# EAGLE design Main v1 (EAGLE 9.7.0)
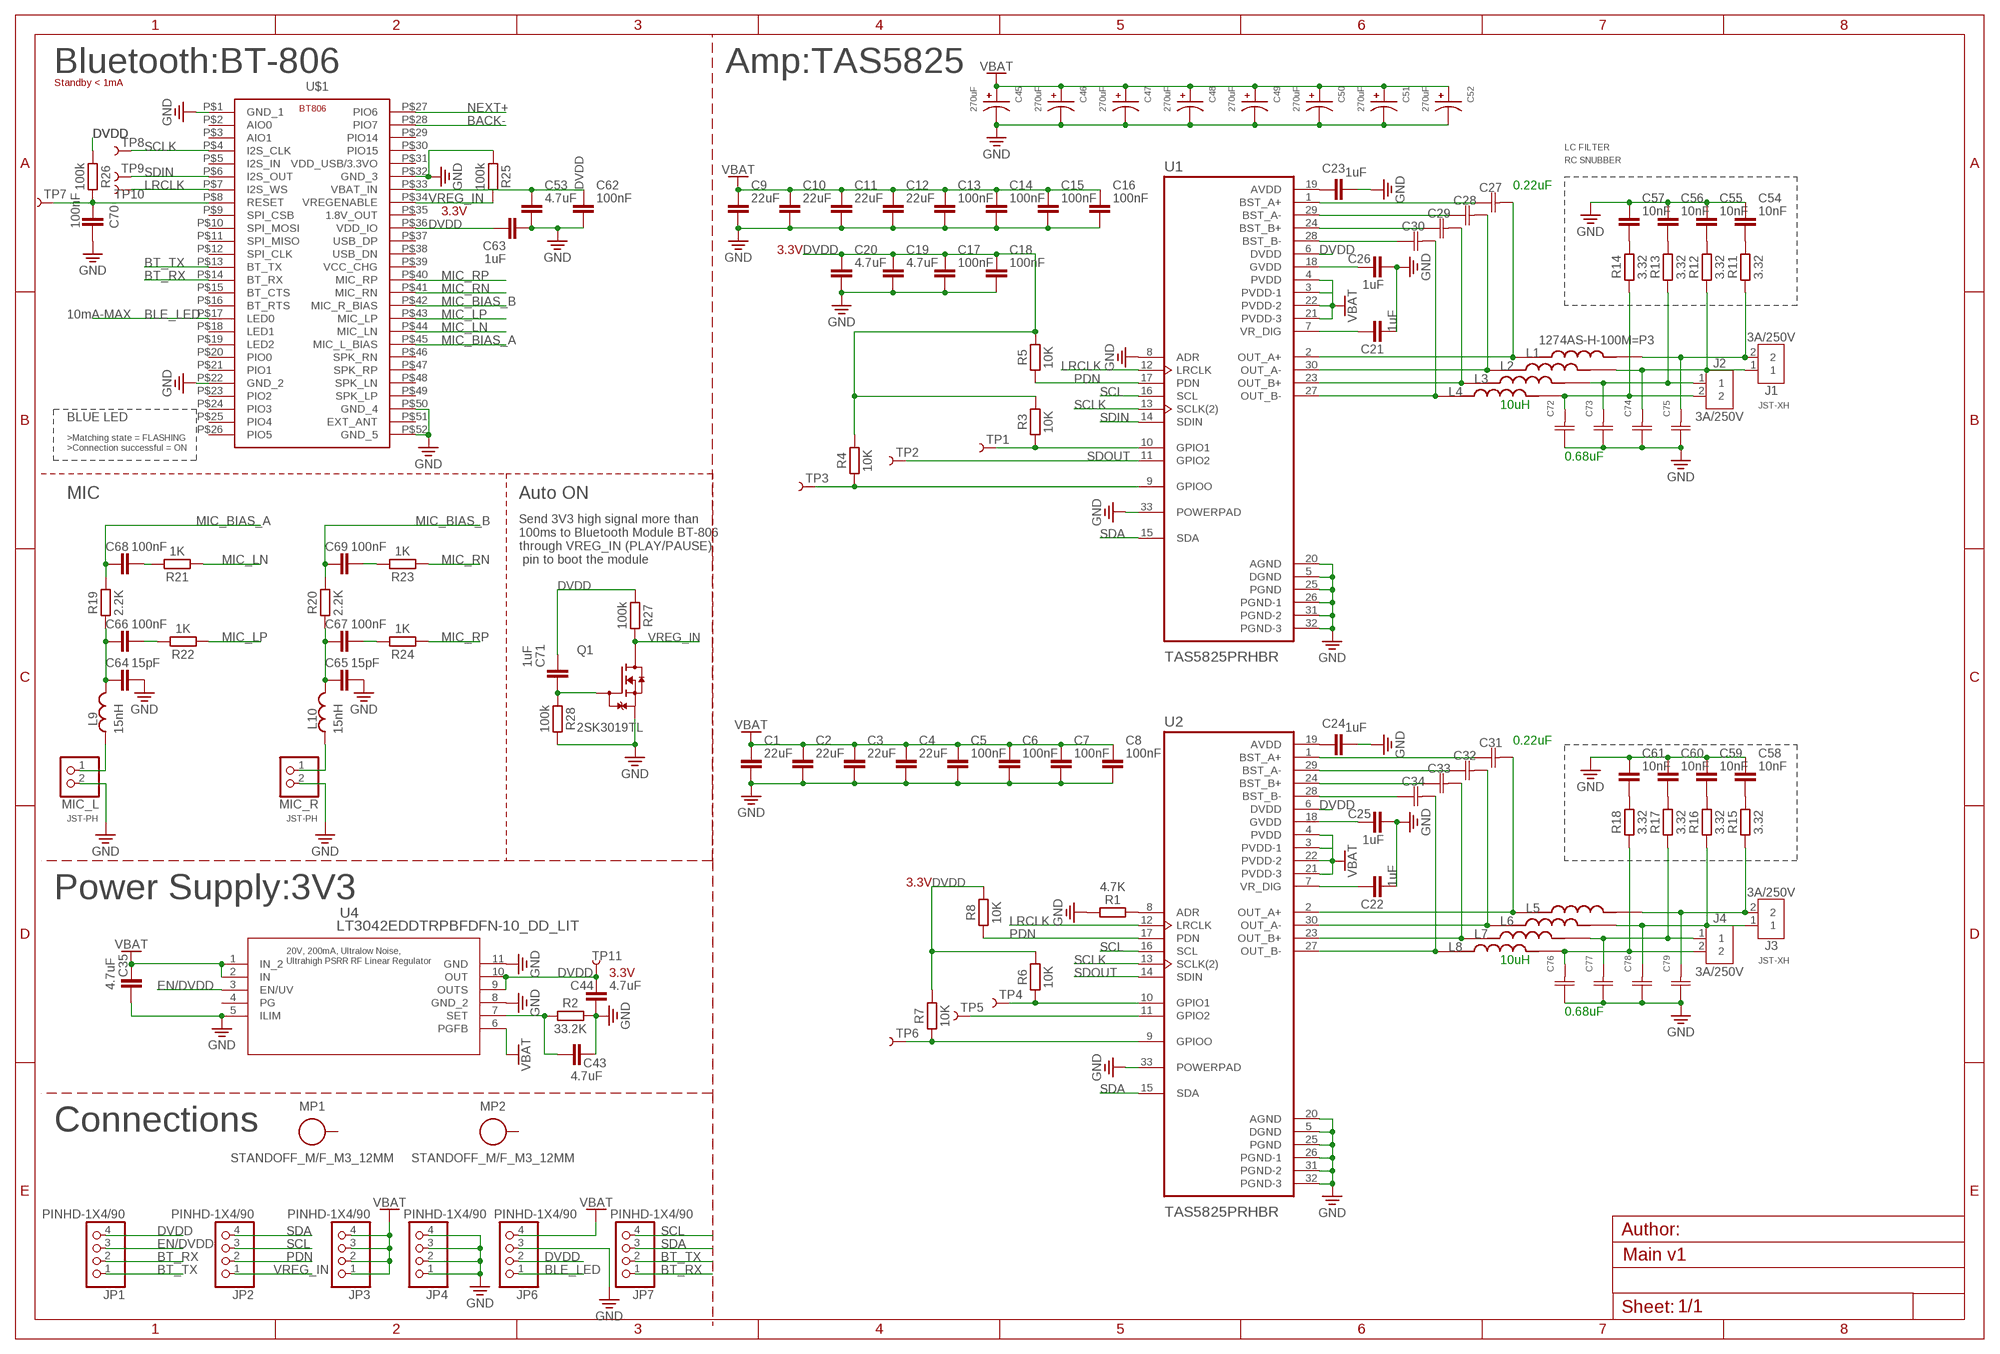
[diagram p0: schematic, sheet 1]

## Parts
C1  22uF  C_CHIP-0805(2012-METRIC)  [CAPC2012X110]
C2  22uF  C_CHIP-0805(2012-METRIC)  [CAPC2012X110]
C3  22uF  C_CHIP-0805(2012-METRIC)  [CAPC2012X110]
C4  22uF  C_CHIP-0805(2012-METRIC)  [CAPC2012X110]
C5  100nF  C_CHIP-0805(2012-METRIC)  [CAPC2012X110]
C6  100nF  C_CHIP-0805(2012-METRIC)  [CAPC2012X110]
C7  100nF  C_CHIP-0805(2012-METRIC)  [CAPC2012X110]
C8  100nF  C_CHIP-0805(2012-METRIC)  [CAPC2012X110]
C9  22uF  C_CHIP-0805(2012-METRIC)  [CAPC2012X110]
C10  22uF  C_CHIP-0805(2012-METRIC)  [CAPC2012X110]
C11  22uF  C_CHIP-0805(2012-METRIC)  [CAPC2012X110]
C12  22uF  C_CHIP-0805(2012-METRIC)  [CAPC2012X110]
C13  100nF  C_CHIP-0805(2012-METRIC)  [CAPC2012X110]
C14  100nF  C_CHIP-0805(2012-METRIC)  [CAPC2012X110]
C15  100nF  C_CHIP-0805(2012-METRIC)  [CAPC2012X110]
C16  100nF  C_CHIP-0805(2012-METRIC)  [CAPC2012X110]
C17  100nF  C_CHIP-0805(2012-METRIC)  [CAPC2012X110]
C18  100nF  C_CHIP-0805(2012-METRIC)  [CAPC2012X110]
C19  4.7uF  C_CHIP-1206(3216-METRIC)  [CAPC3216X135]
C20  4.7uF  C_CHIP-1206(3216-METRIC)  [CAPC3216X135]
C21  1uF  C_CHIP-0805(2012-METRIC)  [CAPC2012X110]
C22  1uF  C_CHIP-0805(2012-METRIC)  [CAPC2012X110]
C23  1uF  C_CHIP-0805(2012-METRIC)  [CAPC2012X110]
C24  1uF  C_CHIP-0805(2012-METRIC)  [CAPC2012X110]
C25  1uF  C_CHIP-0805(2012-METRIC)  [CAPC2012X110]
C26  1uF  C_CHIP-0805(2012-METRIC)  [CAPC2012X110]
C27  0.22uF  PHE426HJ6220JR05CAPM7.2X7.2_5_1_VIS  [CAPM7.2X7.2_5_1_VIS]
C28  0.22uF  PHE426HJ6220JR05CAPM7.2X7.2_5_1_VIS  [CAPM7.2X7.2_5_1_VIS]
C29  0.22uF  PHE426HJ6220JR05CAPM7.2X7.2_5_1_VIS  [CAPM7.2X7.2_5_1_VIS]
C30  0.22uF  PHE426HJ6220JR05CAPM7.2X7.2_5_1_VIS  [CAPM7.2X7.2_5_1_VIS]
C31  0.22uF  PHE426HJ6220JR05CAPM7.2X7.2_5_1_VIS  [CAPM7.2X7.2_5_1_VIS]
C32  0.22uF  PHE426HJ6220JR05CAPM7.2X7.2_5_1_VIS  [CAPM7.2X7.2_5_1_VIS]
C33  0.22uF  PHE426HJ6220JR05CAPM7.2X7.2_5_1_VIS  [CAPM7.2X7.2_5_1_VIS]
C34  0.22uF  PHE426HJ6220JR05CAPM7.2X7.2_5_1_VIS  [CAPM7.2X7.2_5_1_VIS]
C35  4.7uF  C_CHIP-0805(2012-METRIC)  [CAPC2012X110]
C43  4.7uF  C_CHIP-0805(2012-METRIC)  [CAPC2012X110]
C44  4.7uF  C_CHIP-0805(2012-METRIC)  [CAPC2012X110]
C45  270uF  16SVPG270M  [CAP_16SVPG270M]
C46  270uF  16SVPG270M  [CAP_16SVPG270M]
C47  270uF  16SVPG270M  [CAP_16SVPG270M]
C48  270uF  16SVPG270M  [CAP_16SVPG270M]
C49  270uF  16SVPG270M  [CAP_16SVPG270M]
C50  270uF  16SVPG270M  [CAP_16SVPG270M]
C51  270uF  16SVPG270M  [CAP_16SVPG270M]
C52  270uF  16SVPG270M  [CAP_16SVPG270M]
C53  4.7uF  C_CHIP-0805(2012-METRIC)  [CAPC2012X110]
C54  10nF  C_CHIP-0805(2012-METRIC)  [CAPC2012X110]
C55  10nF  C_CHIP-0805(2012-METRIC)  [CAPC2012X110]
C56  10nF  C_CHIP-0805(2012-METRIC)  [CAPC2012X110]
C57  10nF  C_CHIP-0805(2012-METRIC)  [CAPC2012X110]
C58  10nF  C_CHIP-0805(2012-METRIC)  [CAPC2012X110]
C59  10nF  C_CHIP-0805(2012-METRIC)  [CAPC2012X110]
C60  10nF  C_CHIP-0805(2012-METRIC)  [CAPC2012X110]
C61  10nF  C_CHIP-0805(2012-METRIC)  [CAPC2012X110]
C62  100nF  C_CHIP-0805(2012-METRIC)  [CAPC2012X110]
C63  1uF  C_CHIP-0805(2012-METRIC)  [CAPC2012X110]
C64  15pF  C_CHIP-0402(1005-METRIC)  [CAPC1005X60]
C65  15pF  C_CHIP-0402(1005-METRIC)  [CAPC1005X60]
C66  100nF  C_CHIP-0402(1005-METRIC)  [CAPC1005X60]
C67  100nF  C_CHIP-0402(1005-METRIC)  [CAPC1005X60]
C68  100nF  C_CHIP-0402(1005-METRIC)  [CAPC1005X60]
C69  100nF  C_CHIP-0402(1005-METRIC)  [CAPC1005X60]
C70  100nF  C_CHIP-0402(1005-METRIC)  [CAPC1005X60]
C71  1uF  C_CHIP-0805(2012-METRIC)  [CAPC2012X110]
C72  MMK5684J63J03L16.5TR18CAPM7.2X4.5_5_VIS  [CAPM7.2X4.5_5_VIS]
C73  MMK5684J63J03L16.5TR18CAPM7.2X4.5_5_VIS  [CAPM7.2X4.5_5_VIS]
C74  MMK5684J63J03L16.5TR18CAPM7.2X4.5_5_VIS  [CAPM7.2X4.5_5_VIS]
C75  MMK5684J63J03L16.5TR18CAPM7.2X4.5_5_VIS  [CAPM7.2X4.5_5_VIS]
C76  MMK5684J63J03L16.5TR18CAPM7.2X4.5_5_VIS  [CAPM7.2X4.5_5_VIS]
C77  MMK5684J63J03L16.5TR18CAPM7.2X4.5_5_VIS  [CAPM7.2X4.5_5_VIS]
C78  MMK5684J63J03L16.5TR18CAPM7.2X4.5_5_VIS  [CAPM7.2X4.5_5_VIS]
C79  MMK5684J63J03L16.5TR18CAPM7.2X4.5_5_VIS  [CAPM7.2X4.5_5_VIS]
J1  3A/250V  B2B-XH-A  [B2B-XH-A]
J2  3A/250V  B2B-XH-A  [B2B-XH-A]
J3  3A/250V  B2B-XH-A  [B2B-XH-A]
J4  3A/250V  B2B-XH-A  [B2B-XH-A]
JP1  PINHD-1X4/90  [1X04/90]
JP2  PINHD-1X4/90  [1X04/90]
JP3  PINHD-1X4/90  [1X04/90]
JP4  PINHD-1X4/90  [1X04/90]
JP6  PINHD-1X4/90  [1X04/90]
JP7  PINHD-1X4/90  [1X04/90]
L1  1274AS-H-100M=P3  [IND_1274AS-H-100M=P3]
L2  1274AS-H-100M=P3  [IND_1274AS-H-100M=P3]
L3  1274AS-H-100M=P3  [IND_1274AS-H-100M=P3]
L4  1274AS-H-100M=P3  [IND_1274AS-H-100M=P3]
L5  1274AS-H-100M=P3  [IND_1274AS-H-100M=P3]
L6  1274AS-H-100M=P3  [IND_1274AS-H-100M=P3]
L7  1274AS-H-100M=P3  [IND_1274AS-H-100M=P3]
L8  1274AS-H-100M=P3  [IND_1274AS-H-100M=P3]
L9  15nH  L_CHIP-0402(1006-METRIC)  [INDC1006X60N]
L10  15nH  L_CHIP-0402(1006-METRIC)  [INDC1006X60N]
MIC_L  JST_2PIN-THM  [JST-PH-2-THM]
MIC_R  JST_2PIN-THM  [JST-PH-2-THM]
MP1  STANDOFF_M/F_M3_12MM  [STANDOFF_HEX_MALE-FEMALE_550X1200_M3X0.5_MTGP850H320]
MP2  STANDOFF_M/F_M3_12MM  [STANDOFF_HEX_MALE-FEMALE_550X1200_M3X0.5_MTGP850H320]
Q1  2SK3019TL  [TRANS_2SK3019TL]
R1  4.7K  R_CHIP-0402(1005-METRIC)  [RESC1005X40]
R2  33.2K  R_CHIP-0402(1005-METRIC)  [RESC1005X40]
R3  10K  R_CHIP-0402(1005-METRIC)  [RESC1005X40]
R4  10K  R_CHIP-0402(1005-METRIC)  [RESC1005X40]
R5  10K  R_CHIP-0402(1005-METRIC)  [RESC1005X40]
R6  10K  R_CHIP-0402(1005-METRIC)  [RESC1005X40]
R7  10K  R_CHIP-0402(1005-METRIC)  [RESC1005X40]
R8  10K  R_CHIP-0402(1005-METRIC)  [RESC1005X40]
R11  3.32  R_CHIP-0402(1005-METRIC)  [RESC1005X40]
R12  3.32  R_CHIP-0402(1005-METRIC)  [RESC1005X40]
R13  3.32  R_CHIP-0402(1005-METRIC)  [RESC1005X40]
R14  3.32  R_CHIP-0402(1005-METRIC)  [RESC1005X40]
R15  3.32  R_CHIP-0402(1005-METRIC)  [RESC1005X40]
R16  3.32  R_CHIP-0402(1005-METRIC)  [RESC1005X40]
R17  3.32  R_CHIP-0402(1005-METRIC)  [RESC1005X40]
R18  3.32  R_CHIP-0402(1005-METRIC)  [RESC1005X40]
R19  2.2K  R_CHIP-0402(1005-METRIC)  [RESC1005X40]
R20  2.2K  R_CHIP-0402(1005-METRIC)  [RESC1005X40]
R21  1K  R_CHIP-0402(1005-METRIC)  [RESC1005X40]
R22  1K  R_CHIP-0402(1005-METRIC)  [RESC1005X40]
R23  1K  R_CHIP-0402(1005-METRIC)  [RESC1005X40]
R24  1K  R_CHIP-0402(1005-METRIC)  [RESC1005X40]
R25  100k  R_CHIP-0402(1005-METRIC)  [RESC1005X40]
R26  100k  R_CHIP-0402(1005-METRIC)  [RESC1005X40]
R27  100k  R_CHIP-0402(1005-METRIC)  [RESC1005X40]
R28  100k  R_CHIP-0402(1005-METRIC)  [RESC1005X40]
TP1  TEST-POINT3  [PAD.03X.03]
TP2  TEST-POINT3  [PAD.03X.03]
TP3  TEST-POINT3  [PAD.03X.03]
TP4  TEST-POINT3  [PAD.03X.03]
TP5  TEST-POINT3  [PAD.03X.03]
TP6  TEST-POINT3  [PAD.03X.03]
TP7  TEST-POINT3  [PAD.03X.03]
TP8  TEST-POINT3X5  [PAD.03X.05]
TP9  TEST-POINT3X5  [PAD.03X.05]
TP10  TEST-POINT3X5  [PAD.03X.05]
TP11  TEST-POINT3X5  [PAD.03X.05]
U1  TAS5825PRHBR  [IC_ADS125H01IRHBT]
U2  TAS5825PRHBR  [IC_ADS125H01IRHBT]
U4  LT3042EDDTRPBFDFN-10_DD_LIT  [DFN-10_DD_LIT]
U$1  BT806  [BT806]

## Nets
BACK-: U$1.P$28(PIO7)
BLE_LED: JP6.1 U$1.P$17(LED0)
BT_RX: JP1.2 JP7.1 U$1.P$14(BT_RX)
BT_TX: JP1.1 JP7.2 U$1.P$13(BT_TX)
DVDD: C17.1 C18.1 C19.1 C20.1 C44.2 C53.1 C62.1 C63.1 C71.1 JP1.4 JP6.2 R3.2 R4.2 R5.2 R6.2 R7.2 R8.2 R26.1 R27.1 TP11.P$1 U1.6(DVDD) U2.6(DVDD) U4.9(OUTS) U4.10(OUT) U$1.P$33(VBAT_IN) U$1.P$36(VDD_IO)
EN/DVDD: JP1.3 U4.3(EN/UV)
GND: C1.2 C2.2 C3.2 C4.2 C5.2 C6.2 C7.2 C8.2 C9.2 C10.2 C11.2 C12.2 C13.2 C14.2 C15.2 C16.2 C17.2 C18.2 C19.2 C20.2 C21.2 C22.2 C23.2 C24.2 C25.2 C26.2 C35.1 C43.2 C44.1 C45.2 C46.2 C47.2 C48.2 C49.2 C50.2 C51.2 C52.2 C53.2 C54.1 C55.1 C56.1 C57.1 C58.1 C59.1 C60.1 C61.1 C62.2 C63.2 C64.2 C65.2 C70.1 C72.1 C73.1 C74.1 C75.1 C76.1 C77.1 C78.1 C79.1 JP4.1 JP4.2 JP4.3 JP4.4 JP6.3 MIC_L.2 MIC_R.2 Q1.1(S) R1.1 R2.2 R25.1 R28.2 U1.5(DGND) U1.8(ADR) U1.20(AGND) U1.25(PGND) U1.26(PGND-1) U1.31(PGND-2) U1.32(PGND-3) U1.33(POWERPAD) U2.5(DGND) U2.20(AGND) U2.25(PGND) U2.26(PGND-1) U2.31(PGND-2) U2.32(PGND-3) U2.33(POWERPAD) U4.5(ILIM) U4.8(GND_2) U4.11(GND) U$1.P$1(GND_1) U$1.P$22(GND_2) U$1.P$32(GND_3) U$1.P$50(GND_4) U$1.P$52(GND_5)
LRCLK: TP10.P$1 U1.12(LRCLK) U2.12(LRCLK) U$1.P$7(I2S_WS)
MIC_BIAS_A: C68.1 R19.2 U$1.P$45(MIC_L_BIAS)
MIC_BIAS_B: C69.1 R20.2 U$1.P$42(MIC_R_BIAS)
MIC_LN: R21.1 U$1.P$44(MIC_LN)
MIC_LP: R22.1 U$1.P$43(MIC_LP)
MIC_RN: R23.1 U$1.P$41(MIC_RN)
MIC_RP: R24.1 U$1.P$40(MIC_RP)
N$1: R1.2 U2.8(ADR)
N$2: C24.1 U2.19(AVDD)
N$3: C23.1 U1.19(AVDD)
N$4: C26.1 U1.18(GVDD)
N$5: C21.1 U1.7(VR_DIG)
N$6: C25.1 U2.18(GVDD)
N$7: C22.1 U2.7(VR_DIG)
N$8: C27.1 U1.1(BST_A+)
N$9: C28.1 U1.29(BST_A-)
N$10: C29.1 U1.24(BST_B+)
N$11: C30.1 U1.28(BST_B-)
N$12: C31.1 U2.1(BST_A+)
N$13: C32.1 U2.29(BST_A-)
N$14: C33.1 U2.24(BST_B+)
N$15: C34.1 U2.28(BST_B-)
N$16: C27.2 L1.1 U1.2(OUT_A+)
N$17: C28.2 L2.1 U1.30(OUT_A-)
N$18: C29.2 L3.1 U1.23(OUT_B+)
N$19: C30.2 L4.1 U1.27(OUT_B-)
N$20: C31.2 L5.1 U2.2(OUT_A+)
N$21: C32.2 L6.1 U2.30(OUT_A-)
N$22: C33.2 L7.1 U2.23(OUT_B+)
N$23: C34.2 L8.1 U2.27(OUT_B-)
N$24: C77.2 J4.1 L7.2 R17.1
N$25: C78.2 J3.1 L6.2 R16.1
N$26: C79.2 J3.2 L5.2 R15.1
N$27: C72.2 J2.2 L4.2 R14.1
N$28: C75.2 J1.2 L1.2 R11.1
N$29: C76.2 J4.2 L8.2 R18.1
N$30: C74.2 J1.1 L2.2 R12.1
N$31: C73.2 J2.1 L3.2 R13.1
N$32: C43.1 R2.1 U4.7(SET)
N$34: R3.1 TP1.P$1 U1.10(GPIO1)
N$35: R6.1 TP4.P$1 U2.10(GPIO1)
N$36: R4.1 TP3.P$1 U1.9(GPIOO)
N$37: TP5.P$1 U2.11(GPIO2)
N$38: R7.1 TP6.P$1 U2.9(GPIOO)
N$43: C54.2 R11.2
N$44: C55.2 R12.2
N$45: C56.2 R13.2
N$46: C57.2 R14.2
N$47: C58.2 R15.2
N$48: C59.2 R16.2
N$49: C60.2 R17.2
N$50: C61.2 R18.2
N$51: L9.1 MIC_L.1
N$54: L10.1 MIC_R.1
N$55: C64.1 C66.1 L9.2 R19.1
N$56: C70.2 R26.2 TP7.P$1 U$1.P$8(RESET)
N$58: C66.2 R22.2
N$59: C69.2 R23.2
N$60: C67.2 R24.2
N$61: C68.2 R21.2
N$63: C71.2 Q1.2(G) R28.1
N$64: C65.1 C67.1 L10.2 R20.1
NEXT+: U$1.P$27(PIO6)
PDN: JP2.2 R5.1 R8.1 U1.17(PDN) U2.17(PDN)
SCL: JP2.3 JP7.4 U1.16(SCL) U2.16(SCL)
SCLK: TP8.P$1 U1.13(SCLK(2)) U2.13(SCLK(2)) U$1.P$4(I2S_CLK)
SDA: JP2.4 JP7.3 U1.15(SDA) U2.15(SDA)
SDIN: TP9.P$1 U1.14(SDIN) U$1.P$6(I2S_OUT)
SDOUT: TP2.P$1 U1.11(GPIO2) U2.14(SDIN)
VCC: C1.1 C2.1 C3.1 C4.1 C5.1 C6.1 C7.1 C8.1 C9.1 C10.1 C11.1 C12.1 C13.1 C14.1 C15.1 C16.1 C35.2 C45.1 C46.1 C47.1 C48.1 C49.1 C50.1 C51.1 C52.1 JP3.1 JP3.2 JP3.3 JP3.4 JP6.4 U1.3(PVDD-1) U1.4(PVDD) U1.21(PVDD-3) U1.22(PVDD-2) U2.3(PVDD-1) U2.4(PVDD) U2.21(PVDD-3) U2.22(PVDD-2) U4.1(IN_2) U4.2(IN) U4.6(PGFB) ; supply symbol labelled VBAT
VREG_IN: JP2.1 Q1.3(D) R25.2 R27.2 U$1.P$34(VREGENABLE)
Unconnected: MP1.1 MP2.1 U$1.P$2(AIO0) U$1.P$3(AIO1) U$1.P$5(I2S_IN) U$1.P$9(SPI_CSB) U$1.P$10(SPI_MOSI) U$1.P$11(SPI_MISO) U$1.P$12(SPI_CLK) U$1.P$15(BT_CTS) U$1.P$16(BT_RTS) U$1.P$18(LED1) U$1.P$19(LED2) U$1.P$20(PIO0) U$1.P$21(PIO1) U$1.P$23(PIO2) U$1.P$24(PIO3) U$1.P$25(PIO4) U$1.P$26(PIO5) U$1.P$29(PIO14) U$1.P$30(PIO15) U$1.P$31(VDD_USB/3.3VO) U$1.P$35(1.8V_OUT) U$1.P$37(USB_DP) U$1.P$38(USB_DN) U$1.P$39(VCC_CHG) U$1.P$46(SPK_RN) U$1.P$47(SPK_RP) U$1.P$48(SPK_LN) U$1.P$49(SPK_LP) U$1.P$51(EXT_ANT)

## Notes on the sheet
- Bluetooth:BT-806 | Amp:TAS5825
- Standby < 1mA
- LC FILTER
- RC SNUBBER
- 0.22uF
- 3.3V
- 3.3V
- 10mA-MAX
- 10uH | JST-XH
- BLUE LED
- >Matching state = FLASHING
  >Connection successful = ON
- 0.68uF
- MIC | Auto ON
- Send 3V3 high signal more than 
  100ms to Bluetooth Module BT-806 
  through VREG_IN (PLAY/PAUSE)
   pin to boot the module
- 0.22uF
- JST-PH | JST-PH
- 3.3V
- Power Supply:3V3
- 20V, 200mA, Ultralow Noise,
  Ultrahigh PSRR RF Linear Regulator
- 10uH | JST-XH
- 3.3V
- 0.68uF
- Connections

## Power pins joined to a net without a drawn wire
PG: U4.4(PG)

## Library data of the parts
C1-C26 C35 C43 C44 C53-C71 = Capacitor:C: Capacitor - Generic; CATEGORY: Capacitor
C27-C34 = 0.22uF:PHE426HJ6220JR05; COPYRIGHT: Copyright (C) 2021 Ultra Librarian. All rights reserved.; DIGI-KEY_PART_NUMBER_1: 399-PHE426HJ6220JR05-ND; MANUFACTURER_PART_NUMBER: PHE426HJ6220JR05; MFR_NAME: Vishay
C45-C52 = 16SVPG270M:16SVPG270M; MANUFACTURER: Panasonic; MAXIMUM_PACKAGE_HEIGHT: 9.9mm; PARTREV: 05-Mar-21; STANDARD: Manufacturer Recommendations
C72-C79 = MMK5684J63J03L16.5TR18:MMK5684J63J03L16.5TR18; COPYRIGHT: Copyright (C) 2022 Ultra Librarian. All rights reserved.; DIGI-KEY_PART_NUMBER_1: 399-MMK5684J63J03L16.5TR18CT-ND; DIGI-KEY_PART_NUMBER_2: 399-MMK5684J63J03L16.5TR18DKR-ND; DIGI-KEY_PART_NUMBER_3: 399-MMK5684J63J03L16.5TR18TR-ND; MANUFACTURER_PART_NUMBER: MMK5684J63J03L16.5TR18; MFR_NAME: Vishay
J1-J4 = Connector:B2B-XH-A: XH Connector Top Entry - 2POS Details see: Datasheet <http://www.jst-mfg.com/product/pdf/eng/eXH.pdf>; CATEGORY: CONNECTOR; DESCRIPTION: 2.5mm pitch/disconnectable crimp style connector; MANUFACTURER: JST (XH CONNECTOR); MPN: B2B-XH-A; OPERATING_TEMPERATURE: -25°C ~ 85°C; PART_STATUS: ACTIVE; ROHS_COMPLIANT: COMPLIANT; SERIES: B_B-XH-A; SUB_CATEGORY: Through hole connector; TYPE: top entry
JP1-JP4 JP6 JP7 = Connector:PINHD-1X4: PIN HEADER; CATEGORY: CONNECTOR; SUB-CATEGORY: PIN-HEADER
L1-L8 = 1274AS-H-100M_P3:1274AS-H-100M=P3: Inductor Power Shielded Wirewound 22uH 20% 100KHz Ferrite 2.9A 68.1mOhm DCR 3939 T/R; MANUFACTURER: Murata; MAXIMUM_PACKAGE_HEIGHT: 5.0 mm; PARTREV: N/A; STANDARD: Manufacturer Recommendations
L9 L10 = Inductor:L: Inductor Fixed - Generic; CATEGORY: Inductor; SUB-CATEGORY: Fixed
MIC_L MIC_R = adafruit:JST_2PIN: JST 2-Pin Connectors of various flavors SMT-RA (S2B-PH-SM4) 4UConnector #17311 SMT (B2B-PH-SM4) THM-RA (S2B-PH) THM (B2B-PH)
MP1 MP2 = PCB-Fasteners_Hardware:STANDOFF_M/F: Male-Male Standoff/Spacer with Mounting pad and hole. Essentra : Male-Female Standoff <https://www.essentracomponents.co.in/index.php?option=com_virtuemart&view=productdetails&virtuemart_product_id=14556> The hole and pad sizes may vary based on the application and type of hardware; always verify the Manufacturer specification or Global Standards.; CATEGORY: Standoff/Spacer; SUB-CATEGORY: Male-Female
Q1 = 2SK3019TL:2SK3019TL: Single N-Channel 150 mW 30 V 13 Ohm Surface Mount MosFet - EMT-3; MANUFACTURER: ROHM; MAXIMUM_PACKAGE_HEIGHT: 0.8mm; PARTREV: A; STANDARD: Manufacturer recommendations
R1-R8 R11-R28 = Resistor:R: Resistor Fixed - Generic; CATEGORY: Resistor; SUB-CATEGORY: Fixed
TP1-TP11 = SparkFun-Connectors:TEST-POINT: SparkFun Test Points Bare copper test points for troubleshooting or In-Circuit-Testing. These are used by our Production team for verifying production board runs using pogo-pins on test beds. SparkFun Products: SparkFun LSM9DS1 Breakout <https://www.sparkfun.com/products/13284> SparkFun PSOC <https://www.sparkfun.com/products/13714> SparkFun Load Cell Amplifier <https://www.sparkfun.com/products/13879>
U1 U2 = TAS5825PRHBR:TAS5825PRHBR
U4 = LT3042EDD#TRPBF:LT3042EDDTRPBF; COPYRIGHT: Copyright (C) 2021 Ultra Librarian. All rights reserved.; DIGI-KEY_PART_NUMBER_1: LT3042EDD#TRPBFCT-ND; DIGI-KEY_PART_NUMBER_2: LT3042EDD#TRPBFDKR-ND; DIGI-KEY_PART_NUMBER_3: LT3042EDD#TRPBFTR-ND; MANUFACTURER_PART_NUMBER: LT3042EDD#TRPBF; MFR_NAME: Analog Devices / Linear Technology
U$1 = BT806:BT806

## Board
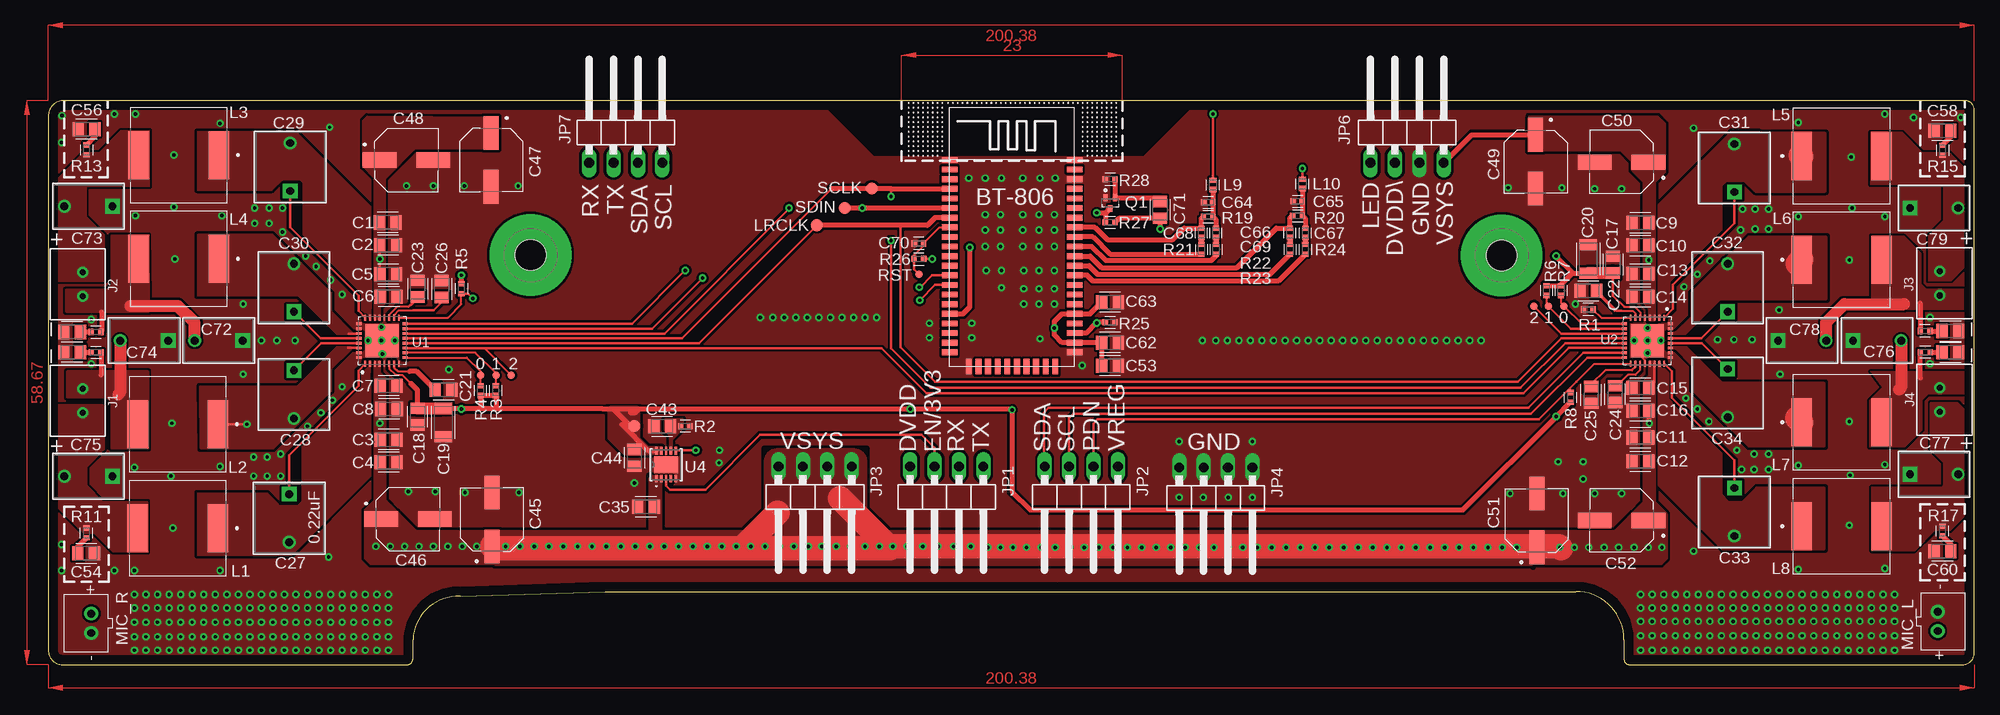
[diagram p1: board, top side]
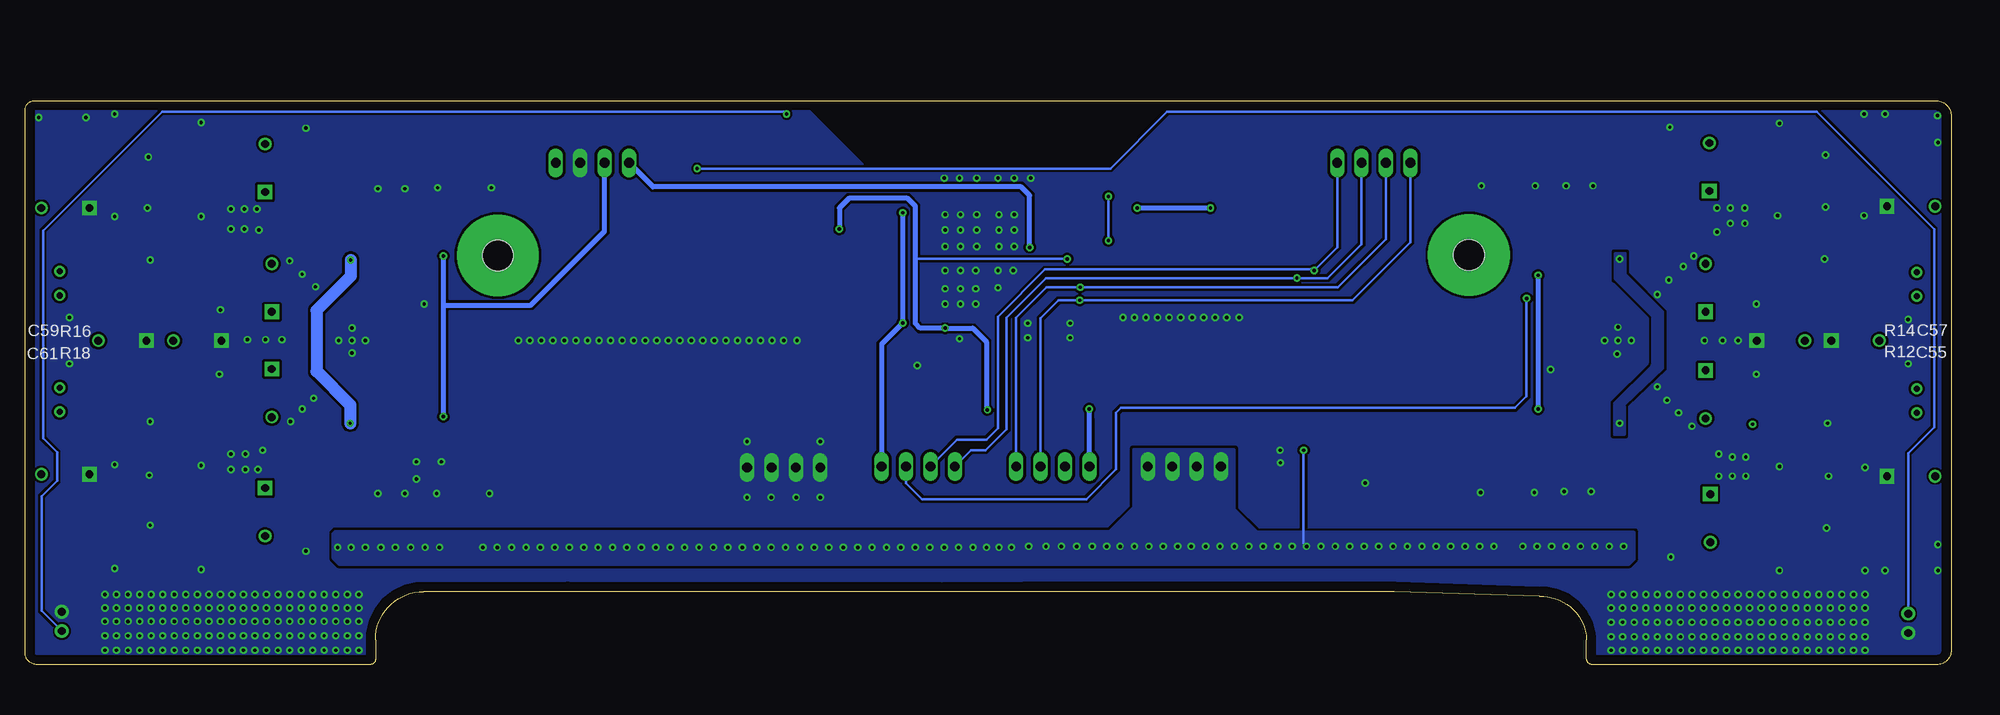
[diagram p2: board, bottom side, seen from below]

Size 200.38 x 58.67 mm. Coordinates in mm from the lower left corner, seen from the top.
Outline: 163.94,2.6 163.94,0.55 arc90 164.49,0 199.19,0 arc90 200.38,1.19 200.38,57.69 arc90 199.4,58.67 1.63,58.67 arc90 0,57.05 0,1.47 arc90 1.47,0 37.35,0 arc90 37.95,0.59 37.95,2.6 arc-90 42.84,7.1 57.95,7.6 91.14,7.58 96.84,7.58 105.01,7.56 143.94,7.6 158.94,7.6 arc-90 163.94,2.6
Copper layers (1*16): Top 0.035mm / dielectric 1.5mm / Bottom 0.035mm
Design rules "default": minimum track width 6mil, minimum drill 0.35mm, track to track 6mil, track to pad 6mil, pad to pad 6mil, via to via 6mil, smd to smd 6mil, copper to edge 40mil, drill to drill 6mil, minimum pad ring 10mil, minimum via ring 8mil, stop-mask expansion 4mil, vias tented up to drill 0mil, thermal gap 10mil

### Footprints (pad centres in the part's own frame; a part is rotated, then mirrored left to right if it is on the bottom)
CAPC2012X110 = smd 1.165 x 1.465: 1 -0.875,0; 2 0.875,0
CAPC3216X135 = smd 1.165 x 1.815: 1 -1.475,0; 2 1.475,0
CAPM7.2X7.2_5_1_VIS = drill 0.813 pad 1.524 square: 1 0,0 | drill 0.813 pad 1.321: 2 5,0
CAP_16SVPG270M = smd 3.5 x 1.6: 1 -2.8,0; 2 2.8,0
CAPC1005X60 = smd 0.56 x 0.629: 1 -0.485,0; 2 0.485,0
CAPM7.2X4.5_5_VIS = drill 0.813 pad 1.524 square: 1 0,0 | drill 0.813 pad 1.321: 2 5,0
B2B-XH-A = drill 0.64: 1 0,0; 2 2.5,0
1X04/90 = drill 1.016 long: 1 -3.81,-3.81; 2 -1.27,-3.81; 3 1.27,-3.81; 4 3.81,-3.81
IND_1274AS-H-100M=P3 = smd 2.15 x 5: 1 -4.175,0; 2 4.175,0
INDC1006X60N = smd 0.56 x 0.729: 1 -0.485,0; 2 0.485,0
JST-PH-2-THM = drill 0.8 pad 1.422: 1 1,0; 2 -1,0
STANDOFF_HEX_MALE-FEMALE_550X1200_M3X0.5_MTGP850H320 = drill 3.2 pad 8.5: 1 0,0 | hole 3.2: 0,0
TRANS_2SK3019TL = smd 0.4 x 0.7: 1 -0.5,0.55; 2 0.5,0.55 | smd 0.5 x 0.7: 3 0,-0.55
RESC1005X40 = smd 0.535 x 0.644: 1 -0.507,0; 2 0.507,0
PAD.03X.03 = smd 0.762 x 0.762: P$1 0,0
PAD.03X.05 = smd 1.27 x 1.27: P$1 0,0
IC_ADS125H01IRHBT = smd 0.6 x 0.25: 1 -2.4,1.75; 2 -2.4,1.25; 3 -2.4,0.75; 4 -2.4,0.25; 5 -2.4,-0.25; 6 -2.4,-0.75; 7 -2.4,-1.25; 8 -2.4,-1.75; 17 2.4,-1.75; 18 2.4,-1.25; 19 2.4,-0.75; 20 2.4,-0.25; 21 2.4,0.25; 22 2.4,0.75; 23 2.4,1.25; 24 2.4,1.75 | smd 0.25 x 0.6: 9 -1.75,-2.4; 10 -1.25,-2.4; 11 -0.75,-2.4; 12 -0.25,-2.4; 13 0.25,-2.4; 14 0.75,-2.4; 15 1.25,-2.4; 16 1.75,-2.4; 25 1.75,2.4; 26 1.25,2.4; 27 0.75,2.4; 28 0.25,2.4; 29 -0.25,2.4; 30 -0.75,2.4; 31 -1.25,2.4; 32 -1.75,2.4 | smd 3.45 x 3.45: 33 0,0
DFN-10_DD_LIT = smd 0.813 x 0.254: 1 -1.448,1; 2 -1.448,0.5; 3 -1.448,0; 4 -1.448,-0.5; 5 -1.448,-1; 6 1.448,-1; 7 1.448,-0.5; 8 1.448,0; 9 1.448,0.5; 10 1.448,1 | smd 1.753 x 2.489: 11 0,0
BT806 = smd 1.6 x 0.6: P$1 0,0; P$2 0,-1; P$3 0,-2; P$4 0,-3; P$5 0,-4; P$6 0,-5; P$7 0,-6; P$8 0,-7; P$9 0,-8; P$10 0,-9; P$11 0,-10; P$12 0,-11; P$13 0,-12; P$14 0,-13; P$15 0,-14; P$16 0,-15; P$17 0,-16; P$18 0,-17; P$19 0,-18; P$20 0,-19; P$21 0,-20; P$32 13,-20; P$33 13,-19; P$34 13,-18; P$35 13,-17; P$36 13,-16; P$37 13,-15; P$38 13,-14; P$39 13,-13; P$40 13,-12; P$41 13,-11; P$42 13,-10; P$43 13,-9; P$44 13,-8; P$45 13,-7; P$46 13,-6; P$47 13,-5; P$48 13,-4; P$49 13,-3; P$50 13,-2; P$51 13,-1; P$52 13,0 | smd 0.6 x 1.6: P$22 2,-21.5; P$23 3,-21.5; P$24 4,-21.5; P$25 5,-21.5; P$26 6,-21.5; P$27 7,-21.5; P$28 8,-21.5; P$29 9,-21.5; P$30 10,-21.5; P$31 11,-21.5

### Placement (x,y rotation side)
C1  35.33,45.99 0 top
C2  35.36,43.62 0 top
C3  35.43,23.41 0 top
C4  35.43,21.03 0 top
C5  35.38,40.62 0 top
C6  35.44,38.25 0 top
C7  35.42,29.01 0 top
C8  35.46,26.59 0 top
C9  165.65,45.98 180 top
C10  165.65,43.6 180 top
C11  165.65,23.62 180 top
C12  165.65,21.14 180 top
C13  165.65,40.66 180 top
C14  165.65,38.28 180 top
C15  165.65,28.8 180 top
C16  165.65,26.42 180 top
C17  162.79,41.61 90 top
C18  38.42,25.79 270 top
C19  41.12,25.17 270 top
C20  160.22,42.19 90 top
C21  41.12,28.57 0 top
C22  160.22,38.89 180 top
C23  38.42,39.11 90 top
C24  163.02,28.13 270 top
C25  160.52,28.05 270 top
C26  40.92,39.07 90 top
C27  25.07,17.73 270 top
C28  25.57,30.6 270 top
C29  25.17,49.26 90 top
C30  25.57,36.7 90 top
C31  175.43,49.16 90 top
C32  174.73,36.7 90 top
C33  175.43,18.37 270 top
C34  174.73,30.74 270 top
C35  62.18,16.4 0 top
C43  63.88,24.8 180 top
C44  60.98,21.5 90 top
C45  46.18,15.1 90 top
C46  37.43,15.15 0 top
C47  46.08,52.51 270 top
C48  37.28,52.51 0 top
C49  154.73,52.31 270 top
C50  163.68,52.26 180 top
C51  154.88,15 90 top
C52  163.68,15 180 top
C53  110.48,31.1 0 top
C54  3.93,11.6 180 top
C55  2.47,32.5 0 top
C56  3.98,55.7 0 top
C57  2.47,34.6 0 top
C58  197.08,55.52 0 top
C59  197.91,34.7 180 top
C60  197.08,11.8 0 top
C61  197.91,32.5 180 top
C62  110.48,33.5 0 top
C63  110.48,37.7 0 top
C64  120.68,48.1 180 top
C65  129.98,48.2 180 top
C66  121.48,44.9 270 top
C67  130.78,44.9 270 top
C68  119.98,44.9 270 top
C69  129.18,44.9 270 top
C70  90.58,43.8 0 top
C71  115.68,47.3 90 top
C72  20.24,33.7 180 top
C73  6.68,47.67 180 top
C74  12.48,33.7 180 top
C75  6.68,19.6 180 top
C76  187.78,33.7 0 top
C77  193.71,19.8 0 top
C78  179.98,33.7 0 top
C79  193.71,47.5 0 top
J1  3.59,28.7 270 top
J2  3.59,40.8 270 top
J3  196.78,38.4 90 top
J4  196.78,26.3 90 top
JP1  93.48,16.8 180 top
JP2  107.48,16.8 180 top
JP3  79.78,16.8 180 top
JP4  121.48,16.7 180 top
JP6  141.38,56 0 top
JP7  60.08,56 0 top
L1  13.48,14.2 180 top
L2  13.48,25 180 top
L3  13.58,53 180 top
L4  13.58,42.2 180 top
L5  186.58,52.9 0 top
L6  186.58,42.1 0 top
L7  186.58,14.4 0 top
L8  186.58,25.2 0 top
L9  121.18,49.9 270 top
L10  130.48,50 270 top
MIC_L  196.58,4.5 270 top
MIC_R  4.48,4.3 90 top
MP1  50.18,42.6 0 top
MP2  151.22,42.56 0 top
Q1  110.48,48 0 top
R1  160.22,36.93 0 top
R2  66.28,24.8 0 top
R3  46.58,28.5 270 top
R4  44.98,28.5 270 top
R5  42.98,39.1 90 top
R6  155.88,38.9 90 top
R7  157.38,38.9 90 top
R8  158.38,27.8 270 top
R11  3.98,13.7 270 top
R12  4.98,32.5 180 top
R13  3.98,53.54 90 top
R14  4.98,34.6 180 top
R15  197.08,53.5 90 top
R16  195.27,34.7 0 top
R17  197.08,13.9 270 top
R18  195.29,32.5 0 top
R19  120.68,46.6 180 top
R20  129.98,46.7 180 top
R21  119.98,43.2 90 top
R22  121.48,43.2 90 top
R23  129.18,43.2 90 top
R24  130.78,43.2 90 top
R25  110.48,35.6 180 top
R26  90.58,42.2 180 top
R27  110.48,46 180 top
R28  110.48,50.5 180 top
TP1  46.58,30.09 0 top
TP2  48.18,30.1 0 top
TP3  44.98,30.09 0 top
TP4  156.08,37.3 0 top
TP5  154.58,37.3 0 top
TP6  157.68,37.3 0 top
TP7  90.58,40.6 0 top
TP8  85.68,49.5 0 top
TP9  82.88,47.5 0 top
TP10  79.98,45.7 0 top
TP11  60.98,24.8 0 top
U1  34.73,33.69 90 top
U2  166.37,33.69 270 top
U4  64.28,20.8 90 top
U$1  93.78,52.49 0 top

### Tracks (layer width: path | path; a pad name or v marks a point on that pad's centre or on a via)
BLE_LED  (via drill 0.35)
  Top 0.508: U$1.P$17 95.17,36.49 95.88,37.2 v95.88,43.4
  Bottom 0.508: v95.88,43.4 95.88,48.8 96.78,49.7 135.08,49.7 JP6.1
BT_RX  (via drill 0.35)
  Top 0.254: U$1.P$14 92.27,39.49 v90.68,37.9
  Bottom 0.254: JP1.2 94.75,36.03 92.88,37.9 v90.68,37.9 62.28,37.9 56.27,43.91 JP7.1
BT_TX  (via drill 0.35)
  Top 0.254: U$1.P$13 91.97,40.49 90.68,39.2 v90.63,39.25
  Bottom 0.254: JP1.1 97.29,36.09 94.13,39.25 v90.63,39.25 63.83,39.25 58.81,44.27 JP7.2
DVDD  (via drill 0.35)
  Top 0.2: 37.73,29.25 36.83,30.15 36.13,30.15 35.48,30.8 U1.6 | 163.98,37.2 165.08,37.2 165.62,36.66 U2.6
  Top 0.254: 163.98,37.2 162.79,38.39 C17.1 | R26.1 v91.98,42.2 | 57.68,26.59 60.19,26.59 60.58,26.2
  Top 0.508: 44.53,26.59 v42.98,26.59 41.17,26.59 C19.1 | R6.2 R7.2 157.38,39.51 158.59,40.72 158.66,40.72 | 158.66,40.72 C20.1 | R27.1 111.41,46.42 C71.1 v115.68,45.3 | C63.1 108.39,36.49 U$1.P$36 105.47,36.49 104.68,35.7 v104.68,35 104.68,34.3 105.49,33.49 U$1.P$33 109.59,33.49 | 109.59,33.49 C62.1 | C53.1 109.59,31.11 109.59,33.49 | C18.1 38.42,28.56 37.73,29.25 | 46.58,26.59 R3.2 R4.2 44.98,26.64 44.48,26.64 44.53,26.59 | 46.58,26.59 57.68,26.59 58.79,26.59 | TP11.P$1 60.58,24.8 58.79,26.59 | 59.69,24.99 62.43,22.25 U4.10 | v42.98,40.5 R5.2 | 60.58,26.2 61.08,26.2 61.38,26.5 | 58.79,26.59 v89.68,26.59 100.19,26.59 v100.28,26.5 100.28,18 102.18,16.1 147.19,16.1 v156.88,25.8 R8.2 | v156.88,42.5 158.66,40.72 | 46.58,26.59 44.53,26.59
  Top 1.27: C17.1 162.77,40.72 C20.1 | C18.1 41.1,26.66 C19.1
  Bottom 0.254: v91.98,42.2 107.78,42.2
  Bottom 0.508: v42.98,26.59 v42.98,40.5 | v115.68,45.3 115.68,47.5 114.68,48.5 108.58,48.5 107.78,47.7 107.78,42.2 107.78,35.5 107.28,35 v104.68,35 101.78,35 100.38,33.6 100.38,26.5 v100.28,26.5 | v156.88,42.5 156.88,37.4 | 156.88,37.4 v156.88,25.8 | 156.88,37.4 147.78,37.4 140.11,45.07 JP6.2 | JP1.4 89.67,25.39 89.68,25.4 v89.68,26.59
  pour Top (no thermals): 63.88,21.8 59.88,21.8 58.18,23.5 58.18,26.9 61.58,26.9 61.58,23.6 62.48,22.7 63.88,22.7
EN/DVDD
  Top 0.254: JP1.3 92.21,22.57 90.88,23.9 74.08,23.9 68.38,18.2 64.68,18.2 64.28,18.6 U4.3
GND  (via drill 0.35)
  Top 0.152: U2.20 166.12,31.64 165.79,31.97 165.79,32.29 165.58,32.5
  other vias: 159.68,21.1 157.08,21.1 159.68,19.3 165.68,7.3 166.88,7.3 168.08,7.3 169.28,7.3 170.48,7.3 171.68,7.3 172.88,7.3 174.08,7.3 175.28,7.3 176.48,7.3 177.68,7.3 178.88,7.3 180.08,7.3 181.28,7.3 182.48,7.3 183.68,7.3 184.88,7.3 186.08,7.3 187.28,7.3 188.48,7.3 189.68,7.3 190.88,7.3 192.08,7.3 165.68,5.9 166.88,5.9 168.08,5.9 169.28,5.9 170.48,5.9 171.68,5.9 172.88,5.9 174.08,5.9 175.28,5.9 176.48,5.9 177.68,5.9 178.88,5.9 180.08,5.9 181.28,5.9 182.48,5.9 183.68,5.9 184.88,5.9 186.08,5.9 187.28,5.9 188.48,5.9 189.68,5.9 190.88,5.9 192.08,5.9 165.68,4.5 166.88,4.5 168.08,4.5 169.28,4.5 170.48,4.5 171.68,4.5 172.88,4.5 174.08,4.5 175.28,4.5 176.48,4.5 177.68,4.5 178.88,4.5 180.08,4.5 181.28,4.5 182.48,4.5 183.68,4.5 184.88,4.5 186.08,4.5 187.28,4.5 188.48,4.5 189.68,4.5 190.88,4.5 192.08,4.5 165.68,3 166.88,3 168.08,3 169.28,3 170.48,3 171.68,3 172.88,3 174.08,3 175.28,3 176.48,3 177.68,3 178.88,3 180.08,3 181.28,3 182.48,3 183.68,3 184.88,3 186.08,3 187.28,3 188.48,3 189.68,3 190.88,3 192.08,3 165.68,1.5 166.88,1.5 168.08,1.5 169.28,1.5 170.48,1.5 171.68,1.5 172.88,1.5 174.08,1.5 175.28,1.5 176.48,1.5 177.68,1.5 178.88,1.5 180.08,1.5 181.28,1.5 182.48,1.5 183.68,1.5 184.88,1.5 186.08,1.5 187.28,1.5 188.48,1.5 189.68,1.5 190.88,1.5 192.08,1.5 8.98,7.3 10.18,7.3 11.38,7.3 12.58,7.3 13.78,7.3 14.98,7.3 16.18,7.3 17.38,7.3 18.58,7.3 19.78,7.3 20.98,7.3 22.18,7.3 23.38,7.3 24.58,7.3 25.78,7.3 26.98,7.3 28.18,7.3 29.38,7.3 30.58,7.3 31.78,7.3 32.98,7.3 34.18,7.3 35.38,7.3 8.98,5.9 10.18,5.9 11.38,5.9 12.58,5.9 13.78,5.9 14.98,5.9 16.18,5.9 17.38,5.9 18.58,5.9 19.78,5.9 20.98,5.9 22.18,5.9 23.38,5.9 24.58,5.9 25.78,5.9 26.98,5.9 28.18,5.9 29.38,5.9 30.58,5.9 31.78,5.9 32.98,5.9 34.18,5.9 35.38,5.9 8.98,4.4 10.18,4.4 11.38,4.4 12.58,4.4 13.78,4.4 14.98,4.4 16.18,4.4 17.38,4.4 18.58,4.4 19.78,4.4 20.98,4.4 22.18,4.4 23.38,4.4 24.58,4.4 25.78,4.4 26.98,4.4 28.18,4.4 29.38,4.4 30.58,4.4 31.78,4.4 32.98,4.4 34.18,4.4 35.38,4.4 8.98,2.9 10.18,2.9 11.38,2.9 12.58,2.9 13.78,2.9 14.98,2.9 16.18,2.9 17.38,2.9 18.58,2.9 19.78,2.9 20.98,2.9 22.18,2.9 23.38,2.9 24.58,2.9 25.78,2.9 26.98,2.9 28.18,2.9 29.38,2.9 30.58,2.9 31.78,2.9 32.98,2.9 34.18,2.9 35.38,2.9 8.98,1.5 10.18,1.5 11.38,1.5 12.58,1.5 13.78,1.5 14.98,1.5 16.18,1.5 17.38,1.5 18.58,1.5 19.78,1.5 20.98,1.5 22.18,1.5 23.38,1.5 24.58,1.5 25.78,1.5 26.98,1.5 28.18,1.5 29.38,1.5 30.58,1.5 31.78,1.5 32.98,1.5 34.18,1.5 35.38,1.5 30.58,38.5 29.38,40 27.88,41.4 26.78,42.5 24.38,45 24.38,47.5 22.98,47.5 22.98,45.9 21.48,47.5 21.48,45.9 30.58,28.9 29.58,27.5 28.38,26.2 26.98,24.8 24.18,21.9 24.18,19.6 22.78,19.6 22.78,21.6 21.38,19.6 21.38,21.6 170.18,39.3 171.58,40.6 172.88,42 176.08,45.2 176.28,47.4 177.58,47.4 178.98,47.4 177.58,45.3 178.98,45.3 170.38,27.7 171.58,26.6 172.78,25.3 175.68,22.3 176.18,20.3 177.48,21.9 177.48,20.3 178.98,20.3 178.98,21.9 191.08,10 182.08,9.9 187.38,14.5 191.08,20.8 182.08,20.7 187.38,25.3 173.68,33.8 175.38,33.8 177.28,33.8 180.08,36.9 180.18,30.2 187.38,42.1 191.08,46.6 182.08,46.6 187.58,52.8 191.08,57.28 182.08,56.4 8.98,9.8 17.88,9.8 12.98,14.2 8.98,20.5 17.88,20.6 12.88,25.1 20.28,30.2 20.28,37.5 25.68,33.7 23.78,33.7 22.18,33.7 13.18,42.2 18.08,46.7 9.08,46.7 13.08,53 17.88,56.3 9.08,57.28 1.43,57.1 1.39,54.3 6.88,57.28 6.88,9.8 1.39,9.8 1.39,12.5 104.78,50.6 103.18,50.6 101.38,50.6 99.18,50.6 97.48,50.6 95.78,50.6 97.48,46.8 99.08,46.8 101.38,46.8 103.08,46.8 104.68,46.8 104.68,45.2 104.68,43.5 104.68,41 104.68,39.1 104.68,37.5 103.08,45.2 103.08,43.5 103.08,41 103.08,39.1 103.08,37.5 101.38,45.2 101.38,43.5 101.48,41 101.48,39.1 101.48,37.5 99.08,45.2 99.08,43.5 99.18,41 99.18,39.2 97.48,45.2 97.48,43.5 97.58,41 91.68,34 91.68,35.5 96.08,34 96.08,35.5 103.18,33.9 107.58,31.1 160.88,49.5 163.68,49.5 157.48,49.6 151.88,49.6 152.08,17.8 157.58,17.8 160.88,17.8 163.68,17.8 48.98,17.9 43.38,17.9 40.28,18 37.48,18 37.28,49.8 40.08,49.8 43.28,49.8 48.88,49.8 125.28,23.2 117.68,23.2 117.68,17.4 120.18,17.4 122.78,17.4 125.28,17.4 60.98,18.9 74.08,36.1 120.08,33.7 121.48,33.7 122.68,33.7 123.88,33.7 125.08,33.7 126.28,33.7 127.48,33.7 128.68,33.7 129.88,33.7 131.08,33.7 132.28,33.7 133.48,33.7 134.68,33.7 135.88,33.7 137.08,33.7 138.28,33.7 139.48,33.7 140.68,33.7 141.88,33.7 143.08,33.7 144.28,33.7 145.48,33.7 146.68,33.7 147.88,33.7 149.08,33.7 75.38,36.1 76.58,36.1 77.78,36.1 78.98,36.1 80.18,36.1 81.38,36.1 82.58,36.1 83.78,36.1 84.98,36.1 86.18,36.1 195.78,36.1 195.78,31.3 158.88,37.5 41.68,30.7 69.84,22.3 69.79,21 4.48,35.9 4.48,31.3 166.38,35 167.78,33.7 166.38,33.7 164.98,33.7 166.38,32.4 34.68,35.1 33.28,33.7 34.68,33.7 36.08,33.7 34.78,32.3 171.18,55.8 171.18,11.8 29.18,11.2 29.28,55.9 13.08,47.6 12.78,19.6 187.48,19.7 187.68,47.5 194.08,56.9 198.98,56.9
  pour Bottom (isolate 0.254, rank 2, no thermals): -5.52,59.6 86.98,59.6 87.78,58.8 87.78,51.5 87.88,51.6 112.68,51.6 122.48,61.4 203.48,61.4 203.48,-1.6 -6.24,-1.6
  pour Top (isolate 0.254, rank 2, no thermals): -3.13,60.8 77.98,60.8 85.88,52.9 113.98,52.9 121.08,60 203.48,60 203.48,-1.6 -17.99,-1.6
LRCLK
  Top 0.254: U2.12 157.42,33.94 152.88,29.4 92.28,29.4 88.68,33 88.68,45.7 TP10.P$1 67.72,33.44 U1.12
  Top 0.508: TP10.P$1 91.48,45.7 92.28,46.5 U$1.P$7
MIC_BIAS_A
  Top 0.508: C68.1 119.98,45.4 | 119.98,45.4 119.98,46.41 R19.2 | U$1.P$45 108.89,45.49 110.18,44.2 116.98,44.2 118.18,45.4 119.98,45.4
MIC_BIAS_B
  Top 0.508: R20.2 129.18,46.41 C69.1 129.17,45.4 127.78,45.4 123.68,41.3 109.58,41.3 108.39,42.49 U$1.P$42
MIC_LN
  Top 0.508: U$1.P$44 108.69,44.49 110.49,42.69 R21.1
MIC_LP
  Top 0.508: U$1.P$43 108.56,43.49 110.03,42.02 120.97,42.02 121.48,42.53 R22.1
MIC_RN
  Top 0.508: U$1.P$41 108.29,41.49 109.18,40.6 127.09,40.6 R23.1
MIC_RP
  Top 0.508: R24.1 127.99,39.9 108.68,39.9 108.08,40.5 U$1.P$40
N$1
  Top 0.2: R1.2 161.57,36.09 U2.8
N$2
  Top 0.2: U2.19 165.6,31.27 165.6,30.62 165.13,30.15 164.36,30.15 163.22,29 C24.1
N$3
  Top 0.2: 37.68,37.4 37.48,37.2 36.28,37.2 35.48,36.4 U1.19
  Top 0.305: 37.68,37.4 38.42,38.13 C23.1
N$4
  Top 0.2: U1.18 35.98,36.35 36.47,36.85 37.98,36.85
  Top 0.254: C26.1 40.92,37.7 40.07,36.85 37.98,36.85
N$5
  Top 0.2: U1.7 35.98,30.9 36.38,30.5 37.58,30.5
  Top 0.508: C21.1 38.31,30.5 37.58,30.5
N$6
  Top 0.2: U2.18 165.12,30.94 164.78,30.6 161.98,30.6 160.52,29.14 C25.1
N$7
  Top 0.2: U2.7 165.12,36.56 164.88,36.8 163.68,36.8 162.98,36.8 161.09,38.69 C22.1
  Top 0.254: C22.1 163.19,36.8 163.68,36.8
N$8
  Top 0.254: C27.1 25.07,21.79 32.28,29 32.28,30.59 U1.1
N$9
  Top 0.254: U1.29 29.54,33.44 29.54,33.45 28.41,33.45 C28.1
N$10
  Top 0.254: U1.24 32.28,36.79 32.28,38.39 25.17,45.5 C29.1
N$11
  Top 0.254: U1.28 28.33,33.94 C30.1
N$12
  Top 0.254: C31.1 175.43,45.9 169.02,39.49 169.02,36.99 U2.1
N$13
  Top 0.254: U2.29 171.97,33.94 C32.1
N$14
  Top 0.254: U2.24 168.92,30.49 168.92,27.76 175.43,21.25 C33.1
N$15
  Top 0.254: U2.28 172.03,33.44 C34.1
N$16
  pour Top (no thermals): 15.48,11.3 25.28,11.3 33.58,19.6 33.58,29.7 33.48,29.8 26.38,22.7 26.38,17 25.98,16.6 15.48,16.6
  pour Top (no thermals): 15.48,16.5 15.48,17.9 22.78,17.9 24.18,16.5
  pour Top (no thermals): 33.59,31.6 33.28,31.6 33.28,31 32.28,30 32.28,28.5 32.48,28.3 33.38,28.3
N$17  (via drill 0.35)
  Top 0.254: 31.22,32.94 U1.30 | L2.1 v20.69,25
  pour Top (no thermals): 15.78,22.4 15.68,29 25.88,29 29.98,33.1 31.58,33.1 31.58,32.8 29.48,30.7 29.48,28.4 23.48,22.4
N$18
  pour Top (no thermals): 15.48,55.5 15.48,49.3 23.28,49.3 24.38,50.4 26.18,50.4 26.48,50.1 26.48,44.7 33.58,37.6 33.58,47.7 25.78,55.5
  pour Top (no thermals): 33.58,35.8 32.28,37.1 32.28,40.2 32.48,40 33.68,40
N$19
  Top 0.254: U1.27 31.24,34.44
  pour Top (no thermals): 15.48,44.8 23.38,44.8 29.48,38.7 29.48,36.8 31.68,34.6 31.68,34.3 29.98,34.3 25.98,38.3 15.48,38.3
N$20
  Top 2.54: L5.1 182.34,52.96
  pour Top (no thermals): 184.98,55.4 184.98,49.1 177.58,49.1 176.48,50.2 174.58,50.2 174.18,49.8 174.18,45.2 167.48,38.5 167.48,47.9 175.08,55.5 177.98,55.5 178.08,55.4
  pour Top (no thermals): 167.48,40 167.68,39.8 168.78,39.8 168.78,37.1 167.68,36 167.48,36
N$21
  Top 2.54: L6.1 182,41.7
  pour Top (no thermals): 185.08,44.6 185.08,37.9 175.28,37.9 175.09,42.81 176.88,44.6
  pour Top (no thermals): 168.48,34.3 170.38,34.3 173.98,37.9 176.08,37.9 176.08,42.3 175.28,43.1 170.88,38.7 170.88,36.2 169.28,34.6 168.68,34.6
N$22
  pour Top (no thermals): 184.88,11.9 174.18,11.9 167.48,18.6 167.48,30.8 167.78,30.8 167.78,28.4 174.18,22 174.18,17.7 174.88,17 176.18,17 177.68,18.5 184.88,18.5
  pour Top (no thermals): 167.48,29.41 167.48,31.5 167.68,31.5 168.88,30.3 168.88,30.1 168.98,30 168.98,25.31
N$23
  Top 2.54: L8.1 181.96,25.64
  pour Top (no thermals): 168.48,32.8 168.48,33.1 170.48,33.1 174.18,29.4 184.88,29.4 184.88,22.6 176.88,22.6 170.98,28.5 170.98,31.1 169.28,32.8
N$24
  pour Top (no thermals): 189.68,11.8 194.18,11.8 196.28,13.9 197.88,13.9 199.38,15.4 199.38,26.6 198.68,27.3 195.88,27.3 195.78,27.2 195.78,22.4 197.18,21 197.18,18.7 196.98,18.5 189.68,18.5
N$25
  Top 0.508: 194.77,37.6 R16.1
  Top 1.27: C78.2 184.98,35.6 186.88,37.5 193.08,37.5
  pour Top (no thermals): 189.68,44.6 193.08,44.6 194.88,42.8 194.88,39.6 195.38,39.1 199.28,39.1 199.28,36.9 189.68,36.9
  pour Top (no thermals): 190.48,36.9 190.48,37.6 190.68,37.8 193.18,37.8 193.18,36.9
N$26
  pour Top (no thermals): 189.58,55.4 192.88,55.4 194.98,53.3 197.78,53.3 199.58,51.5 199.58,41.5 197.98,39.9 195.58,39.9 195.58,44.6 197.18,46.2 197.18,49.8 197.08,49.9 189.58,49.9
N$27
  Top 0.508: 5.56,36.67 5.56,34.67 R14.1
  Top 1.27: C72.2 15.24,35.54 13.48,37.3 8.58,37.3
  pour Top (no thermals): 10.48,44.7 6.48,44.7 6.48,39.4 6.18,39.1 1.78,39.1 1.78,36.6 10.56,36.6
N$28
  Top 0.2: R11.1
  pour Top (no thermals): 10.38,11.7 6.68,11.7 4.78,13.6 3.68,13.6 0.98,16.3 0.98,27.1 5.68,27.1 5.88,26.9 5.88,22.4 4.08,20.6 4.08,18.6 5.68,17 10.38,17
N$29
  Top 0.508: 194.78,29.8 R18.1
  Top 1.27: C76.2 192.78,28.8 192.58,28.6
  pour Top (no thermals): 189.48,22.6 193.18,22.6 194.98,24.4 194.98,27.5 195.58,28.1 199.38,28.1 199.38,30.5 192.48,30.5 189.48,27.5
  pour Top (no thermals): 189.58,30.5 193.18,30.5 193.18,25.65
N$30
  Top 0.2: 5.49,30.6 R12.1
  Top 0.508: R12.1 5.49,30.1
  Top 1.27: C74.2 7.48,28.3 7.28,28.1
  pour Top (no thermals): 10.48,22.4 10.48,30.6 1.88,30.6 1.88,27.7 6.08,27.7 6.48,27.3 6.48,22.4
N$31
  Top 0.2: 3.93,53.03 R13.1 4.01,53
  pour Top (no thermals): 10.58,55.6 7.58,55.6 5.28,53.3 3.68,53.3 0.98,50.6 0.98,39.8 5.88,39.8 5.88,44.7 3.98,46.6 3.98,49.6 4.08,49.7 10.58,49.7
N$32
  pour Top (no thermals): 64.08,25.6 64.08,24.3 64.58,23.8 64.58,21.8 64.98,21.8 64.98,23.4 66.08,24.5 66.08,25.6
N$34
  Top 0.2: R3.1 TP1.P$1 46.58,30.29 44.43,32.44 U1.10
N$35
  Top 0.2: R6.1 155.88,37.5 TP4.P$1
  Top 0.254: U2.10 158.44,34.94 TP4.P$1
N$36
  Top 0.2: R4.1 TP3.P$1 44.98,30.49 43.53,31.94 U1.9
N$37
  Top 0.254: U2.11 157.44,34.44 TP5.P$1
N$38
  Top 0.2: R7.1 157.38,37.6 TP6.P$1
  Top 0.254: U2.9 159.54,35.44 TP6.P$1
N$43
  Top 0.508: C54.2 3.06,12.27 R11.2
N$44
  Top 0.508: C55.2 R12.2
N$45
  Top 0.508: R13.2 4.86,54.92 C56.2
N$46
  Top 0.508: C57.2 R14.2
N$47
  Top 0.508: R15.2 197.96,54.88 C58.2
N$48
  Top 0.508: R16.2 C59.2
N$49
  Top 0.508: R17.2 197.96,12.52 C60.2
N$50
  Top 0.508: R18.2 C61.2
N$51  (via drill 0.35)
  Top 0.254: v121.18,57.28 L9.1
  Bottom 0.254: MIC_L.1 198.68,5.6 198.68,17.5 197.08,19.1 197.08,22.1 198.54,23.56 198.54,45.14 186.15,57.53 121.18,57.53 v121.18,57.28
N$54  (via drill 0.35)
  Top 0.254: v130.48,51.6 L10.1
  Bottom 0.254: MIC_R.1 4.48,22 1.78,24.7 1.78,45.3 13.98,57.5 81.58,57.5 87.48,51.6 v130.48,51.6
N$55
  Top 0.2: L9.2 121.18,48.12 C64.1 121.19,48.08 R19.1
  Top 0.508: L9.2 121.19,49.41 R19.1 121.48,46.31 C66.1
N$56
  Top 0.2: U$1.P$8 92.72,45.49 91.06,43.84 C70.2
  Top 0.254: C70.2 91.06,43.59 90.07,42.59 R26.2 90.07,41.11 TP7.P$1
N$58
  Top 0.508: C66.2 R22.2
N$59
  Top 0.508: C69.2 R23.2
N$60
  Top 0.508: C67.2 R24.2
N$61
  Top 0.508: R21.2 C68.2
N$63
  Top 0.508: R28.1 Q1.2 115.63,48.55 116.18,48 115.86,48 C71.2
N$64
  Top 0.2: R20.1 130.49,48.18 C65.1 130.48,48.22 L10.2
  Top 0.508: L10.2 130.49,49.51 R20.1 130.78,46.41 C67.1
PDN  (via drill 0.35)
  Top 0.2: U1.17 41.58,36.1 42.98,37.5 R5.1 | U2.17 160.87,31.29 158.98,29.4 158.38,28.8 R8.1
  Top 0.254: JP2.2 108.75,25.07 109.18,25.5 155.08,25.5 158.98,29.4 | v44.18,38.1 43.68,38.6 R5.1
  Bottom 0.254: JP2.2 108.75,18.87 107.08,17.2 89.98,17.2 86.88,20.3 86.88,26.2 86.38,26.7 45.38,26.7 44.18,27.9 v44.18,38.1
SCL  (via drill 0.35)
  Top 0.254: JP2.3 106.21,25.63 106.68,26.1 154.28,26.1 160.12,31.94 U2.16 | v66.28,41 60.72,35.44 U1.16
  Bottom 0.254: JP2.3 103.42,23.4 100.38,23.4 99.18,24.6 99.18,36.2 94.28,41.1 66.38,41.1 v66.28,41 63.88,43.4 JP7.4
SCLK  (via drill 0.35)
  Top 0.2: 37.15,33.96 U1.13
  Top 0.254: U2.13 157.82,33.44 153.18,28.8 91.78,28.8 87.68,32.9 v87.68,44.1 | v87.68,48.7 87.68,49.5 | 37.15,33.96 65.94,33.96 81.48,49.5
  Top 0.508: U$1.P$4 87.68,49.5 TP8.P$1 81.48,49.5
  Bottom 0.254: v87.68,48.7 v87.68,44.1
SDA  (via drill 0.35)
  Top 0.254: U2.15 159.72,32.44 153.98,26.7 104.08,26.7 103.58,26.2 103.58,20.7 JP2.4 | U1.15 62.82,34.94 v68.08,40.2
  Bottom 0.254: JP2.4 101.97,22.31 100.47,22.31 98.28,24.5 98.28,36.1 94.18,40.2 v68.08,40.2 64.88,40.2 61.35,43.73 JP7.3
SDIN  (via drill 0.35)
  Top 0.2: TP9.P$1 U$1.P$6
  Top 0.254: U1.14 64.12,34.44 77.08,47.4
  Top 0.508: U$1.P$6 82.89,47.49 TP9.P$1 v84.68,47.5 | v77.08,47.5 77.08,47.4
  Bottom 0.508: v84.68,47.5 v77.08,47.5
SDOUT
  Top 0.254: U2.14 158.22,32.94 153.48,28.2 91.38,28.2 86.68,32.9 45.38,32.9 | 45.38,32.9 37.17,32.9 U1.11 | TP2.P$1 45.38,32.9
VCC  (via drill 0.35)
  Top 0.254: 167.12,29.39 U2.22 | C5.1 v34.5,42.2 34.49,42.22 C2.1 | U4.6 65.33,22.3 v67.38,22.3
  Top 0.508: 166.6,25.1 166.58,25.12 | 166.58,25.12 166.58,25.7 | 166.58,25.12 v166.58,25.1 | JP6.4 148.11,55.11 C49.1
  Top 2.54: 72.18,12.1 46.38,12.1 C45.1 | 72.18,12.1 87.58,12.1 87.38,12.3 | 87.38,12.3 157.18,12.3 157.38,12.1 | 87.38,12.3 82.38,17.3 | 72.18,12.1 75.88,15.8
  Bottom 0.254: v67.38,22.3 67.38,12.6 v67.08,12.3
  Bottom 1.27: v166.53,42.1 166.53,40.4 170.08,36.84 170.08,30.5 166.58,27 v166.58,25.1
  other vias: 34.5,25.1 100.38,12.2 34.08,12.3 35.58,12.3 37.08,12.3 38.58,12.3 40.08,12.3 41.58,12.3 43.08,12.3 44.58,12.3 47.58,12.3 49.08,12.3 50.58,12.3 52.08,12.3 53.58,12.3 55.08,12.3 56.58,12.3 58.08,12.3 59.58,12.3 61.08,12.3 62.58,12.3 64.08,12.3 65.58,12.3 68.58,12.3 70.08,12.3 71.58,12.3 73.08,12.3 74.58,12.3 76.08,12.3 77.58,12.3 79.08,12.3 101.78,12.2 103.28,12.2 104.78,12.2 106.28,12.2 107.78,12.2 109.28,12.2 110.78,12.2 112.28,12.2 113.78,12.2 115.28,12.2 116.78,12.2 118.28,12.2 119.78,12.2 121.28,12.2 122.78,12.2 124.28,12.2 125.78,12.2 127.28,12.2 128.78,12.2 130.28,12.2 131.78,12.2 133.28,12.2 134.78,12.2 136.28,12.2 137.78,12.2 139.28,12.2 140.78,12.2 142.28,12.2 143.78,12.2 145.28,12.2 146.78,12.2 148.28,12.2 149.78,12.2 151.28,12.2 152.78,12.2 157.28,12.2 158.78,12.2 160.28,12.2 80.48,12.3 81.98,12.3 83.48,12.3 84.98,12.3 86.48,12.3 87.88,12.3 89.38,12.3 90.98,12.3 92.58,12.3 94.18,12.3 95.98,12.3 97.78,12.2 99.08,12.2 161.88,12.2 163.38,12.2 164.98,12.2 166.48,12.2 167.88,12.2
  pour Top (no thermals): 153.98,53.4 163.58,53.4 164.68,52.3 164.68,51.4 165.88,50.2 165.88,37.6 166.48,37 167.28,37 167.28,50.2 168.28,51.2 168.28,56.3 167.48,57.1 153.98,57.1
  pour Top (no thermals): 154.08,10.4 154.08,14 162.98,14 165.88,16.9 165.88,29.5 166.48,30.1 166.48,31.6 167.28,31.6 167.28,16.9 168.48,15.7 168.48,11 167.88,10.4
  pour Top (no thermals): 46.88,57 46.88,53.6 38.18,53.6 35.08,50.5 35.08,37.4 33.88,37.4 33.88,50.6 32.68,51.8 32.68,56.6 33.18,57.1
  pour Top (no thermals): 33.88,37.6 33.88,35.8 34.58,35.8 34.58,37.1 35.08,37.6
  pour Top (no thermals): 46.98,14 38.28,14 35.18,17.1 35.18,29.8 34.58,30.4 34.58,31.6 33.88,31.6 33.88,17.1 32.88,16.1 32.88,11 33.48,10.4 46.98,10.4
  pour Bottom: 31.18,31.3 31.18,36.2 34.98,40 35.08,40 35.08,42.9 33.78,42.9 33.78,40.6 29.88,36.7 29.88,31 32.49,28.39
  pour Bottom: 33.88,27.2 33.88,23.8 35.18,23.8 35.18,25.9
  pour Bottom: 35.18,25.8 35.18,27.2 31.18,31.2 29.88,31.2 29.88,30.8
  pour Top (no thermals): 74.48,22.5 74.48,11 83.68,11 85.18,12.5 85.18,22.5
  pour Top (no thermals): 63.88,19.7 62.48,19.7 62.48,12.5 62.68,12.3 63.88,12.3
  pour Top (no thermals): 166.48,37 166.48,35.7 167.28,35.7 167.28,37.3 167.18,37.4 166.38,37.4
  pour Top (no thermals): 46.28,14 154.48,14 154.48,10.1 154.28,10.3 46.38,10.3
  pour Bottom (isolate 0.254, no thermals): 74.48,22.5 74.48,16.2 72.18,13.9 32.88,13.9 32.88,10.9 33.48,10.3 167.78,10.3 168.48,11 168.48,13.7 168.18,14 87.58,14 85.18,16.4 85.18,22.5
VREG_IN  (via drill 0.35)
  Top 0.508: R27.2 109.97,46.94 Q1.3 110.03,47 v109.08,47 | U$1.P$34 107.97,34.49 109.03,35.55 v109.08,35.55 109.18,35.65 109.93,35.65 R25.2
  Bottom 0.508: v109.08,47 v109.08,35.55 111.29,33.34 JP2.1
(copper drawn outside any net)
  shapes: Top area x4

### Text on the board
tNames: . | . | . | . | . | . | . | . | . | . | . | . | . | . | . | . | . | . | . | . | . | . | . | . | . | . | . | . | . | . | . | . | . | . | . | . | . | . | . | . | . | . | . | . | . | . | . | . | . | . | . | . | . | . | . | . | . | . | . | . | . | . | . | . | . | . | . | . | . | . | . | . | . | . | . | . | . | . | . | . | . | . | . | . | . | . | . | . | . | . | . | . | . | . | . | . | . | . | . | . | . | . | . | . | . | . | . | . | . | . | . | . | . | . | . | . | . | . | . | . | . | . | . | . | . | . | . | . | . | . | . | . | . | . | . | . | . | . | . | . | . | . | . | . | . | . | . | . | . | . | . | . | . | . | . | . | . | . | . | . | . | . | . | . | . | . | . | . | . | . | . | . | . | . | . | . | . | . | . | . | . | . | . | . | . | . | . | . | . | . | . | . | . | . | . | . | . | . | . | . | . | . | . | . | . | . | . | . | . | . | . | . | . | . | . | . | . | . | . | . | . | . | . | . | . | . | . | . | . | . | . | . | . | . | . | . | . | . | . | . | . | . | . | . | . | . | . | . | . | RX | TX | SDA | SCL | LED | DVDD\ | GND | VSYS | SCLK | BT-806 | SDIN | LRCLK | + | + | RST | 2 | 1 | 0 | _ | _ | _ | _ | 0 | 1 | 2 | VSYS | GND | + | DVDD | EN/3V3 | RX | TX | SDA | SCL | PDN | VREG | +